# Altium project MotorDriverPCB.PrjPCB
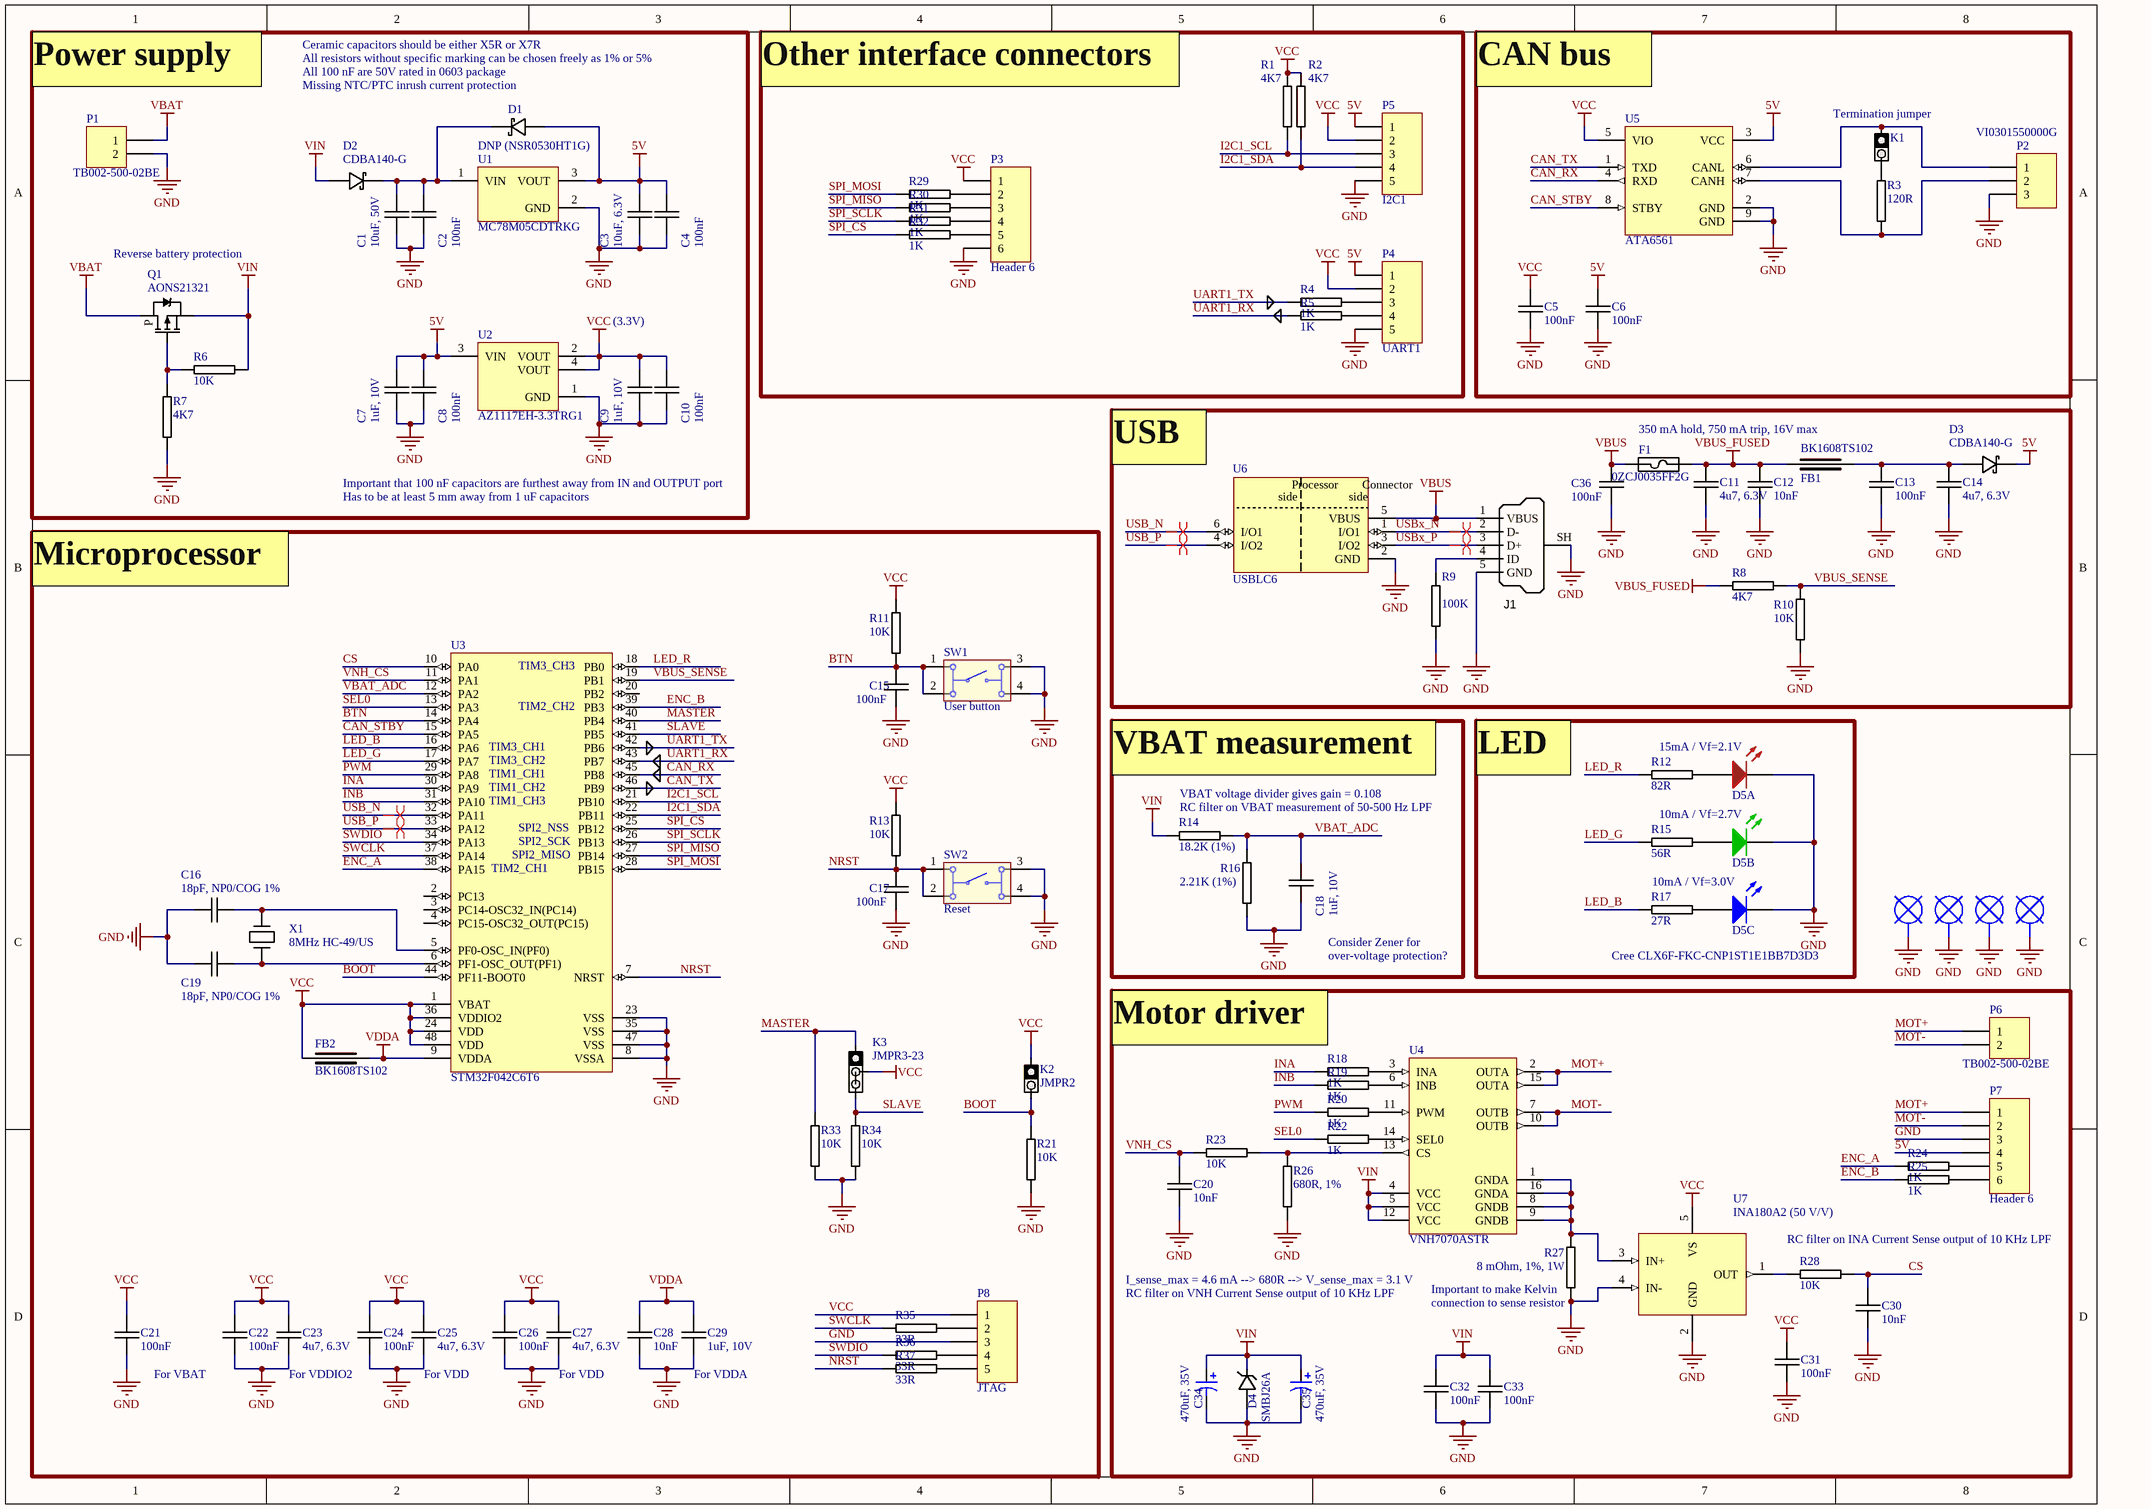
[diagram p0: MotorDriverPCB.SchDoc]
1 sheet, 108 parts. Net scope: global (net labels, ports and power ports of the same name join across sheets).
Board file: MotorDriverPCB.PcbDoc

## Sheet MotorDriverPCB.SchDoc
size A3

### Parts
C1  10uF, 50V  [1206C-GENERIC]
C2  100nF  [0603C-GENERIC]
C3  10uF, 6.3V  [0805C-GENERIC]
C4  100nF  [0603C-GENERIC]
C5  100nF  [0603C-GENERIC]
C6  100nF  [0603C-GENERIC]
C7  1uF, 10V  [0603C-GENERIC]
C8  100nF  [0603C-GENERIC]
C9  1uF, 10V  [0603C-GENERIC]
C10  100nF  [0603C-GENERIC]
C11  4u7, 6.3V  [0603C-GENERIC]
C12  10nF  [0603C-GENERIC]
C13  100nF  [0603C-GENERIC]
C14  4u7, 6.3V  [0603C-GENERIC]
C15  100nF  [0603C-GENERIC]
C16  18pF, NP0/COG 1%  [0603C-GENERIC]
C17  100nF  [0603C-GENERIC]
C18  1uF, 10V  [0603C-GENERIC]
C19  18pF, NP0/COG 1%  [0603C-GENERIC]
C20  10nF  [0603C-GENERIC]
C21  100nF  [0603C-GENERIC]
C22  100nF  [0603C-GENERIC]
C23  4u7, 6.3V  [0603C-GENERIC]
C24  100nF  [0603C-GENERIC]
C25  4u7, 6.3V  [0603C-GENERIC]
C26  100nF  [0603C-GENERIC]
C27  4u7, 6.3V  [0603C-GENERIC]
C28  10nF  [0603C-GENERIC]
C29  1uF, 10V  [0603C-GENERIC]
C30  10nF  [0603C-GENERIC]
C31  100nF  [0603C-GENERIC]
C32  100nF  [0603C-GENERIC]
C33  100nF  [0603C-GENERIC]
C34  470uF, 35V  [SMT_10x10.5]
C35  470uF, 35V  [SMT_10x10.5]
C36  100nF  [0603C-GENERIC]
D1  DNP (NSR0530HT1G)  [SOD323]
D2  CDBA140-G  [DO-214AC-SMA]
D3  CDBA140-G  [DO-214AC-SMA]
D4  SMBJ26A  [DO-214AA]
D5  LED RGB Individual  [LED-3535-6]  (value not drawn)  (parts A,B,C of 3)
F1  0ZCJ0035FF2G  [1206C-GENERIC]
FB1  BK1608TS102  [0603FB-GENERIC]
FB2  BK1608TS102  [0603FB-GENERIC]
H1  SCREW-HOLE  [Screw-hole-3mm]  (value not drawn)
H2  SCREW-HOLE  [Screw-hole-3mm]  (value not drawn)
H3  SCREW-HOLE  [Screw-hole-3mm]  (value not drawn)
H4  SCREW-HOLE  [Screw-hole-3mm]  (value not drawn)
J1  USB Type B  [USB-MINI-B]  (value not drawn)
K1  JMPR2  [JMPR2]  (value not drawn)
K2  JMPR2  [JMPR2]
K3  JMPR3-23  [JMPR3-CLOSED-23]
P1  TB002-500-02BE  [SCREW-2-5mm]
P2  VI0301550000G  [SCREW-3-5mm]
P3  Header 6  [HEADER-1X6]
P4  UART1  [HEADER-1X5]
P5  I2C1  [HEADER-1X5]
P6  TB002-500-02BE  [SCREW-2-5mm]
P7  Header 6  [HEADER-1X6]
P8  JTAG  [HEADER-1X5]
Q1  AONS21321  [SO8FL-DFN5x6]
R1  4K7  [0603R-4K7]
R2  4K7  [0603R-4K7]
R3  120R  [0603R-120]
R4  1K  [0603R-1k]
R5  1K  [0603R-1k]
R6  10K  [0603R-10K]
R7  4K7  [0603R-4K7]
R8  4K7  [0603R-4K7]
R9  100K  [0603R-100K]
R10  10K  [0603R-10K]
R11  10K  [0603R-10K]
R12  82R  [0603R-82]
R13  10K  [0603R-10K]
R14  18.2K (1%)  [0603R-18K]
R15  56R  [0603R-56]
R16  2.21K (1%)  [0603R-2K2]
R17  27R  [0603R-27]
R18  1K  [0603R-1k]
R19  1K  [0603R-1k]
R20  1K  [0603R-1k]
R21  10K  [0603R-10K]
R22  1K  [0603R-1k]
R23  10K  [0603R-10K]
R24  1K  [0603R-1k]
R25  1K  [0603R-1k]
R26  680R, 1%  [0603R-680]
R27  8 mOhm, 1%, 1W  [2512R-GENERIC]
R28  10K  [0603R-10K]
R29  1K  [0603R-1k]
R30  1K  [0603R-1k]
R31  1K  [0603R-1k]
R32  1K  [0603R-1k]
R33  10K  [0603R-10K]
R34  10K  [0603R-10K]
R35  33R  [0603R-33]
R36  33R  [0603R-33]
R37  33R  [0603R-33]
SW1  User button  [TACT-TH-6x6]
SW2  Reset  [TACT-TH-6x6]
U1  MC78M05CDTRKG  [DPAK]
U2  AZ1117EH-3.3TRG1  [SOT-223]
U3  STM32F042C6T6  [STM-LQFP48_N]
U4  VNH7070ASTR  [STM-SO-16N_M]
U5  ATA6561  [VDFN8]
U6  USBLC6  [SOT23-6]
U7  INA180A2 (50 V/V)  [SOT23-5]
X1  8MHz HC-49/US  [HC-49/US]

### Blocks framed on the sheet
Termination jumper: C5 C6 K1 P2 R3 U5
350 mA hold, 750 mA trip, 16V max: C11-C14 C36 D3 F1 FB1 J1 R8-R10 U6

### Nets
5V: C3.1 C4.1 C6.1 C7.1 C8.1 D1.A D3.K P4.1 P5.1 P7.4 U1.3(VOUT) U2.3(VIN) U5.3(VCC)
GND: C1.2 C2.2 C3.2 C4.2 C5.2 C6.2 C7.2 C8.2 C9.2 C10.2 C11.2 C12.2 C13.2 C14.2 C15.2 C16.1 C17.2 C18.2 C19.1 C20.2 C21.2 C22.2 C23.2 C24.2 C25.2 C26.2 C27.2 C28.2 C29.2 C30.2 C31.2 C32.2 C33.2 C34.2 C35.2 C36.2 D4.A D5.KB(K) D5.KG(K) D5.KR(K) H1.0 H2.0 H3.0 H4.0 J1.5(GND) J1.SH(Shell) P1.2 P2.3 P3.6 P4.5 P5.5 P7.3 P8.3 R7.2 R9.2 R10.1 R16.2 R21.1 R26.2 R27.1 R33.1 R34.1 SW1.3 SW1.4 SW2.3 SW2.4 U1.2(GND) U2.1(GND) U3.8(VSSA) U3.23(VSS) U3.35(VSS) U3.47(VSS) U5.2(GND) U5.9(GND) U6.2(GND) U7.2(GND) U7.4(IN-)
VBAT: P1.1 Q1.D
VBUS: C36.1 F1.1 J1.1(VBUS) U6.5(VBUS)
VBUS_FUSED: C11.1 C12.1 F1.2 FB1.1 R8.1
VCC: C5.1 C9.1 C10.1 C21.1 C22.1 C23.1 C24.1 C25.1 C26.1 C27.1 C31.1 FB2.1 K2.1 K3.2 P3.1 P4.2 P5.2 P8.1 R1.1 R2.1 R11.2 R13.2 U2.2(VOUT) U2.4(VOUT) U3.1(VBAT) U3.24(VDD) U3.36(VDDIO2) U3.48(VDD) U5.5(VIO) U7.5(VS)
VDDA: C28.1 C29.1 FB2.2 U3.9(VDDA)
VIN: C32.1 C33.1 C34.1 C35.1 D2.A D4.K Q1.S R6.2 R14.1 U4.4(VCC) U4.5(VCC) U4.12(VCC)
BOOT: K2.2 R21.2 U3.44(PF11-BOOT0)
BTN: C15.1 R11.1 SW1.1 SW1.2 U3.14(PA4)
CAN_RX: U3.45(PB8) U5.4(RXD)
CAN_STBY: U3.15(PA5) U5.8(STBY)
CAN_TX: U3.46(PB9) U5.1(TXD)
CS: C30.1 R28.2 U3.10(PA0)
ENC_A: R24.1 U3.38(PA15)
ENC_B: R25.1 U3.39(PB3)
I2C1_SCL: P5.3 R1.2 U3.21(PB10)
I2C1_SDA: P5.4 R2.2 U3.22(PB11)
INA: R18.1 U3.30(PA9)
INB: R19.1 U3.31(PA10)
LED_B: R17.1 U3.16(PA6)
LED_G: R15.1 U3.17(PA7)
LED_R: R12.1 U3.18(PB0)
MASTER: K3.1 R33.2 U3.40(PB4)
MOT+: P6.1 P7.1 U4.2(OUTA) U4.15(OUTA)
MOT-: P6.2 P7.2 U4.7(OUTB) U4.10(OUTB)
NRST: C17.1 R13.1 R37.1 SW2.1 SW2.2 U3.7(NRST)
PWM: R20.1 U3.29(PA8)
SEL0: R22.1 U3.13(PA3)
SLAVE: K3.3 R34.2 U3.41(PB5)
SPI_CS: R32.1 U3.25(PB12)
SPI_MISO: R30.1 U3.27(PB14)
SPI_MOSI: R29.1 U3.28(PB15)
SPI_SCLK: R31.1 U3.26(PB13)
SWCLK: R35.1 U3.37(PA14)
SWDIO: R36.1 U3.34(PA13)
UART1_RX: R5.1 U3.43(PB7)
UART1_TX: R4.1 U3.42(PB6)
USB_N: U3.32(PA11) U6.6(I/O1)
USB_P: U3.33(PA12) U6.4(I/O2)
USBx_N: J1.2(D-) U6.1(I/O1)
USBx_P: J1.3(D+) U6.3(I/O2)
VBAT_ADC: C18.1 R14.2 R16.1 U3.12(PA2)
VBUS_SENSE: R8.2 R10.2 U3.19(PB1)
VNH_CS: C20.1 R23.1 U3.11(PA1)
NetC1_1: C1.1 C2.1 D1.K D2.K U1.1(VIN)
NetC13_1: C13.1 C14.1 D3.A FB1.2
NetC16_2: C16.2 U3.5(PF0-OSC_IN(PF0)) X1.1
NetC19_2: C19.2 U3.6(PF1-OSC_OUT(PF1)) X1.2
NetD5_AB: D5.AB(A) R17.2
NetD5_AG: D5.AG(A) R15.2
NetD5_AR: D5.AR(A) R12.2
NetJ1_4: J1.4(ID) R9.1
NetK1_1: K1.1 P2.1 U5.6(CANL)
NetK1_2: K1.2 R3.1
NetP2_2: P2.2 R3.2 U5.7(CANH)
NetP3_2: P3.2 R29.2
NetP3_3: P3.3 R30.2
NetP3_4: P3.4 R31.2
NetP3_5: P3.5 R32.2
NetP4_3: P4.3 R4.2
NetP4_4: P4.4 R5.2
NetP7_5: P7.5 R24.2
NetP7_6: P7.6 R25.2
NetP8_2: P8.2 R35.2
NetP8_4: P8.4 R36.2
NetP8_5: P8.5 R37.2
NetQ1_G: Q1.G R6.1 R7.1
NetR18_2: R18.2 U4.3(INA)
NetR19_2: R19.2 U4.6(INB)
NetR20_2: R20.2 U4.11(PWM)
NetR22_2: R22.2 U4.14(SEL0)
NetR23_2: R23.2 R26.1 U4.13(CS)
NetR27_2: R27.2 U4.1(GNDA) U4.8(GNDB) U4.9(GNDB) U4.16(GNDA) U7.3(IN+)
NetR28_1: R28.1 U7.1(OUT)

Not connected (* = marked no-connect by the designer): U3 2(PC13) 3(PC14-OSC32_IN(PC14)) 4(PC15-OSC32_OUT(PC15)) 20(PB2)

### Layout directives
differential pair: USB_N, USB_P, USBx_N, USBx_P

### Notes on the sheet
- Ceramic capacitors should be either X5R or X7R
- Power supply
- All resistors without specific marking can be chosen freely as 1% or 5%
- (near D1) Missing NTC/PTC inrush current protection
- (near D1) All 100 nF are 50V rated in 0603 package
- Other interface connectors
- CAN bus
- Reverse battery protection
- (3.3V)
- Important that 100 nF capacitors are furthest away from IN and OUTPUT port
- Has to be at least 5 mm away from 1 uF capacitors
- USB
- Microprocessor
- (near U3) TIM2_CH2
- (near U3) TIM3_CH3
- (near U3) TIM1_CH1
- (near U3) TIM3_CH1
- (near U3) TIM3_CH2
- VBAT measurement
- LED
- 15mA / Vf=2.1V
- (near U3) TIM1_CH2
- (near U3) TIM1_CH3
- (near U3) SPI2_MISO
- (near U3) SPI2_NSS
- (near U3) SPI2_SCK
- (near R14) RC filter on VBAT measurement of 50-500 Hz LPF
- (near R14) VBAT voltage divider gives gain = 0.108
- 10mA / Vf=2.7V
- (near U3) TIM2_CH1
- 10mA / Vf=3.0V
- Consider Zener for
- over-voltage protection?
- Cree CLX6F-FKC-CNP1ST1E1BB7D3D3
- Motor driver
- RC filter on INA Current Sense output of 10 KHz LPF
- RC filter on VNH Current Sense output of 10 KHz LPF
- I_sense_max = 4.6 mA --> 680R --> V_sense_max = 3.1 V
- (near R27) Important to make Kelvin
- (near R27) connection to sense resistor
- For VBAT
- For VDDIO2
- (near C25) For VDD
- (near C27) For VDD
- (near C29) For VDDA
- (in symbol MOSFET-P) P
- (in symbol USBLC6) Processor; Connector; side

### Library data of the parts
C1 = 1206C-10U-35V-X7R: GENERIC CAPACITOR NON POLARISED 1206; Manufacturer Part Number: GMK316F106ZL-T; Manufacturer: Taiyo Yuden; Description: CAP CER 10UF 35V Y5V 1206; Supplier 1: Digi-Key; Supplier Part Number 1: 587-1352-2-ND
C2 C4-C6 C8 C10 C13 C15 C17 C21 C22 C24 C26 C31-C33 C36 = 0603C-100NF-25V-X7R-TDK: GENERIC CAPACITOR NON POLARISED 0603; Manufacturer Part Number: C1608X7R1E104K; Manufacturer: TDK Corporation; Reel: C12; Description: CAP CER .10UF 25V X7R 10% 0603; Supplier 1: Digi-Key; Supplier Part Number 1: 445-1316-2-ND
C3 = 0805C-10UF-6V3-X5R-PAN: CAPACITOR 0805 CERAMIC; Manufacturer: Panasonic - ECG; Manufacturer Part Number: ECJ-2FB0J106M; Reel: C1; Capacitance: 10µF; Temperature Coefficient: X5R; Tolerance: ±20%; Description: CAP 10UF 6.3V CERAMIC X5R 0805; Supplier 1: Digi-Key; Supplier Part Number 1: PCC2225TR-ND; Supplier: Digi-Key; Operating Temperature: -55°C ~ 85°C; Mounting Type: Surface Mount, MLCC; Voltage - Rated: 6.3V; Lead Spacing: -; RoHS: RoHS Compliant; Packaging: Tape & Reel (TR); Thickness: 1.25mm; Package / Case: 0805 (2012 metric); Features: General Purpose; Category: Capacitors; Supplier Part Number: PCC2225TR-ND
C7 C9 C18 C29 = 0603C-1UF-35V-X5R-TAY: CAPACITOR 0603 CERAMIC; Manufacturer Part Number: GMK107BJ105KA-T; Manufacturer: Taiyo Yuden; Reel: MAN; Description: CAP CER 1.0UF 35V X5R 0603; Supplier 1: Digi-Key; Supplier Part Number 1: 587-1437-2-ND
C11 C14 C23 C25 C27 = 0603C-4U7-6V3-X5R-KEM: GENERIC CAPACITOR NON POLARISED 0603; Reel: C36
C12 C20 C28 C30 = 0603C-10NF-50V-X7R-MUR: GENERIC CAPACITOR NON POLARISED 0603; Manufacturer Part Number: GRM188R71H103KA01D; Manufacturer: Murata Electronics North America; Reel: C22; Description: CAP CER 10000PF 50V 10% X7R 0603; Supplier 1: Digi-Key; Supplier Part Number 1: 490-1512-2-ND
C16 C19 = 0603C-15PF-50V-C0G-MUR: GENERIC CAPACITOR NON POLARISED 0603; Reel: C2
C34 C35 = AluCap_SMT: Surface mount, Polarized Electrolytic Aluminum Capacitor
D1-D3 = DIODE_SCHOTTKY: Diode Schottky; Diode Type: Schottky
D4 = DIODE_TVS: Diode SMD Transil
F1 = FUSE-PTC: PTC Resettable Fuse
FB1 FB2 = 0603FB-GENERIC: FERRITE BEAD SMD
H1-H4 = SCREW-HOLE: PCB Screw hole
J1 = USB-Type-B: Connector SMD-THD USB Type B middle mount; Manufacturer 1: FCI; Manufacturer Part Number 1: 10103594-0001LF; SCDType: undef; Package / Case: SMD/THD mid-mount; Supplier 1: Digi-Key; Supplier Part Number 1: 609-4050-1-ND
K1 K2 = JMPR2: JMPR2 OPEN BY DEFAULT; Manufacturer: Sullins Connector Solutions; Manufacturer Part Number: PBC36SAAN; Description: CONN HEADER .100 SINGL STR 36POS; Supplier 1: Digi-Key; Supplier Part Number 1: S1011E-36-ND; Reel: Open
K3 = JMPR3-23: JMPR3; Manufacturer: Sullins Connector Solutions; Manufacturer Part Number: PBC36SAAN; Description: CONN HEADER .100 SINGL STR 36POS; Reel: Closed 2-3; Supplier 1: Digi-Key; Supplier Part Number 1: S1011E-36-ND
P1 P6 = SCREW-2: Screw terminal, 2-pin, 5mm pitch
P2 = SCREW-3: Screw terminal, 3-pin, 5mm pitch
P3 P7 = Header 6: Header, 6-Pin; LatestRevisionDate: 17-Jul-2002; LatestRevisionNote: Re-released for DXP Platform.; Publisher: Altium Limited
P4 P5 P8 = Header 5: Header, 5-Pin
Q1 = MOSFET-P: P-Channel MOSFET; Published: 8-Jun-2000; LatestRevisionDate: 17-Jul-2002; LatestRevisionNote: Re-released for DXP Platform.; PackageVersion: 1995/1996; PackageReference: E3; Publisher: Altium Limited
R1 R2 R7 R8 = 0603R-4K7: GENERIC RESISTOR 0603; Manufacturer: Stackpole Electronics Inc; Manufacturer Part Number: RMCF 1/16 4.7K 1% R; Description: RES 4.7K OHM 1/10W 1% 0603 SMD; Reel: R23; Supplier 1: Digi-Key; Supplier Part Number 1: RMCF1/164.7KFRTR-ND
R3 = 0603R-120: GENERIC RESISTOR 0603; Manufacturer Part Number: RMC 1/16 120 1% R; Manufacturer: Stackpole Electronics Inc; Power (Watts): 0.1W, 1/10W; Description: RES TF 1/10W 120 OHM 1% 0603; Temperature Coefficient: ±100ppm/°C; Tolerance: ±1%; Resistance In Ohms: 120; Supplier 1: Digi-Key; Supplier Part Number 1: RMC1/16120FR-ND; RoHS: RoHS non-compliant; Composition: Thick Film; Supplier: Digi-Key; Lead Style: Surface Mount (SMD - SMT); Packaging: Tape & Reel (TR); Supplier Part Number: RMC1/16120FR-ND; Case: 0603 (1608 metric); Category: Resistors
R4 R5 R18-R20 R22 R24 R25 R29-R32 = 0603R-1K: GENERIC RESISTOR 0603; Manufacturer Part Number: RMCF 1/16 1K 1% R; Manufacturer: Stackpole Electronics Inc; Reel: R14; Supplier 1: Digi-Key; Supplier Part Number 1: RMCF1/161KFRTR-ND
R6 R10 R11 R13 R21 R23 R28 R33 R34 = 0603R-10K: GENERIC RESISTOR 0603; Manufacturer: Stackpole Electronics Inc; Manufacturer Part Number: RMCF 1/16 10K 1% R; Tolerance: ±1%; Power (Watts): 0.1W, 1/10W; Temperature Coefficient: ±100ppm/°C; Description: RES 10K OHM 1/10W 1% 0603 SMD; Resistance In Ohms: 10.0K; Reel: R21; Category: Resistors; Supplier Part Number: RMCF1/1610KFRDKR-ND; Lead Style: Surface Mount (SMD - SMT); RoHS: RoHS Compliant; Packaging: Digi-Reel®; Case: 0603 (1608 metric); Composition: Thick Film; Supplier: Digi-Key; Supplier 1: Digi-Key; Supplier Part Number 1: RMCF1/1610KFRDKR-ND
R9 = 0603R-100K: GENERIC RESISTOR 0603; Manufacturer Part Number: RMCF 1/16 100K 1% R; Manufacturer: Stackpole Electronics Inc; Tolerance: ±1%; Power (Watts): 0.1W, 1/10W; Description: RES 100K OHM 1/10W 1% 0603 SMD; Temperature Coefficient: ±100ppm/°C; Case: 0603 (1608 metric); Resistance In Ohms: 100K; RoHS: RoHS Compliant; Composition: Thick Film; Lead Style: Surface Mount (SMD - SMT); Supplier: Digi-Key; Supplier Part Number: RMCF1/16100KFRCT-ND; Category: Resistors; Packaging: Cut Tape (CT); Supplier 1: Digi-Key; Supplier Part Number 1: RMCF1/16100KFRCT-ND
R12 = 0603R-82R: GENERIC RESISTOR 0603; Manufacturer: Stackpole Electronics Inc; Manufacturer Part Number: RMC 1/16 82 1% R; Temperature Coefficient: ±100ppm/°C; Power (Watts): 0.1W, 1/10W; Resistance In Ohms: 82.0; Description: RES TF 1/10W 82 OHM 1% 0603; Tolerance: ±1%; Supplier 1: Digi-Key; Supplier Part Number 1: RMC1/1682FR-ND; Supplier: Digi-Key; Lead Style: Surface Mount (SMD - SMT); Packaging: Tape & Reel (TR); Supplier Part Number: RMC1/1682FR-ND; Composition: Thick Film; RoHS: RoHS non-compliant; Case: 0603 (1608 metric); Category: Resistors
R14 = 0603R-18K: GENERIC RESISTOR 0603; Manufacturer Part Number: RMC 1/16 18K 1% R; Manufacturer: Stackpole Electronics Inc; Temperature Coefficient: ±100ppm/°C; Power (Watts): 0.1W, 1/10W; Resistance In Ohms: 18.0K; Description: RES TF 1/10W 18K OHM 1% 0603; Supplier 1: Digi-Key; Supplier Part Number 1: RMC1/1618KFR-ND; Tolerance: ±1%; Lead Style: Surface Mount (SMD - SMT); RoHS: RoHS non-compliant; Supplier Part Number: RMC1/1618KFR-ND; Composition: Thick Film; Case: 0603 (1608 metric); Packaging: Tape & Reel (TR); Category: Resistors; Supplier: Digi-Key
R15 = 0603R-56R: GENERIC RESISTOR 0603; Manufacturer: Stackpole Electronics Inc; Manufacturer Part Number: RMC 1/16 56 1% R; Resistance In Ohms: 56.0; Description: RES TF 1/10W 56 OHM 1% 0603; Power (Watts): 0.1W, 1/10W; Temperature Coefficient: ±100ppm/°C; Tolerance: ±1%; Supplier 1: Digi-Key; Supplier Part Number 1: RMC1/1656FR-ND; Category: Resistors; Case: 0603 (1608 metric); Supplier Part Number: RMC1/1656FR-ND; Lead Style: Surface Mount (SMD - SMT); Composition: Thick Film; Packaging: Tape & Reel (TR); Supplier: Digi-Key; RoHS: RoHS non-compliant
R16 = 0603R-2K2: GENERIC RESISTOR 0603; Manufacturer Part Number: RMC 1/16 2.2K 1% R; Manufacturer: Stackpole Electronics Inc; Description: RES TF 1/10W 2.2K OHM 1% 0603; Reel: R22; Supplier 1: Digi-Key; Supplier Part Number 1: RMC1/162.2KFR-ND
R17 = 0603R-27R: GENERIC RESISTOR 0603; Manufacturer: Stackpole Electronics Inc; Manufacturer Part Number: RMC 1/16 27 1% R; Description: RES TF 1/10W 27 OHM 1% 0603; Power (Watts): 0.1W, 1/10W; Resistance In Ohms: 27.0; Tolerance: ±1%; Temperature Coefficient: ±100ppm/°C; Supplier 1: Digi-Key; Supplier Part Number 1: RMC1/1627FR-ND; Packaging: Tape & Reel (TR); Supplier Part Number: RMC1/1627FR-ND; Lead Style: Surface Mount (SMD - SMT); Case: 0603 (1608 metric); Category: Resistors; RoHS: RoHS Compliant; Supplier: Digi-Key; Composition: Thick Film
R26 = 0603R-680: GENERIC RESISTOR 0603; Manufacturer Part Number: RMC 1/16 680 1% R; Manufacturer: Stackpole Electronics Inc; Resistance In Ohms: 680; Description: RES TF 1/10W 680 OHM 1% 0603; Temperature Coefficient: ±100ppm/°C; Power (Watts): 0.1W, 1/10W; Supplier 1: Digi-Key; Supplier Part Number 1: RMC1/16680FR-ND; Packaging: Tape & Reel (TR); Supplier: Digi-Key; Composition: Thick Film; Case: 0603 (1608 metric); Category: Resistors; RoHS: RoHS Compliant; Tolerance: ±1%; Lead Style: Surface Mount (SMD - SMT); Supplier Part Number: RMC1/16680FR-ND
R27 = 2512R: POWER RESISTOR 2512
R35-R37 = 0603R-33: GENERIC RESISTOR 0603; Manufacturer Part Number: RMC 1/16 33 1% G; Manufacturer: Stackpole Electronics Inc; Description: RES TF 1/10W 33 OHM 1% 0603; Resistance In Ohms: 33.0; Power (Watts): 0.1W, 1/10W; Temperature Coefficient: ±100ppm/°C; Tolerance: ±1%; Reel: R18; Supplier 1: Digi-Key; Supplier Part Number 1: RMC1/1633FG-ND; Supplier: Digi-Key; Lead Style: Surface Mount (SMD - SMT); Composition: Thick Film; Packaging: Tape & Reel (TR); Supplier Part Number: RMC1/1633FG-ND; Case: 0603 (1608 metric); RoHS: RoHS Compliant; Category: Resistors
SW1 SW2 = Tactile Switch
U1 = MC78M05CDTRKG: 5V, 500mA, LDO Regulator, 3-Pin DDPAK; ComponentLink1Description: Datasheet; ComponentLink1URL: http://ww1.microchip.com/downloads/en/DeviceDoc/22001c.pdf; ComponentLink2Description: Packaging Specification; ComponentLink2URL: http://www.microchip.com/stellent/groups/techpub_sg/documents/packagingspec/en012702.pdf
U2 = AZ1117EH-3.3TRG1: 3.3V, 1A, LDO Regulator, 3-Pin SOT-223
U3 = STM32F042C6T6: IC MCU 32BIT 32KB FLASH 48LQFP
U4 = VNH7070ASTR: SO 16 .15 TO JEDEC MS-012; Logic Function: AND; Interface: PWM; Output Current: 15A; Mount: Surface Mount; Case/Package: SOIC; Number of Pins: 16; Min Operating Temperature: -40°C; Max Operating Temperature: 150°C; Packaging: Tape and Reel; Lead Free: Lead Free
U5 = ATA6561: High-Speed CAN Transceiver with Standby Mode  CAN FD Ready
U6 = USBLC6: Very low capacitance ESD protection
U7 = INA180A: INAx180 Low- and high-side voltage output, current-sense amplifiers
X1 = HC-49/US
D5 = LED RGB Individual: Digikey: https://www.digikey.com/product-detail/en/cree-inc/CLX6F-FKC-CNP1ST1E1BB7D3D3/CLX6F-FKC-CNP1ST1E1BB7D3D3CT-ND/6362814